# EAGLE schematic power-control (EAGLE 6.4)
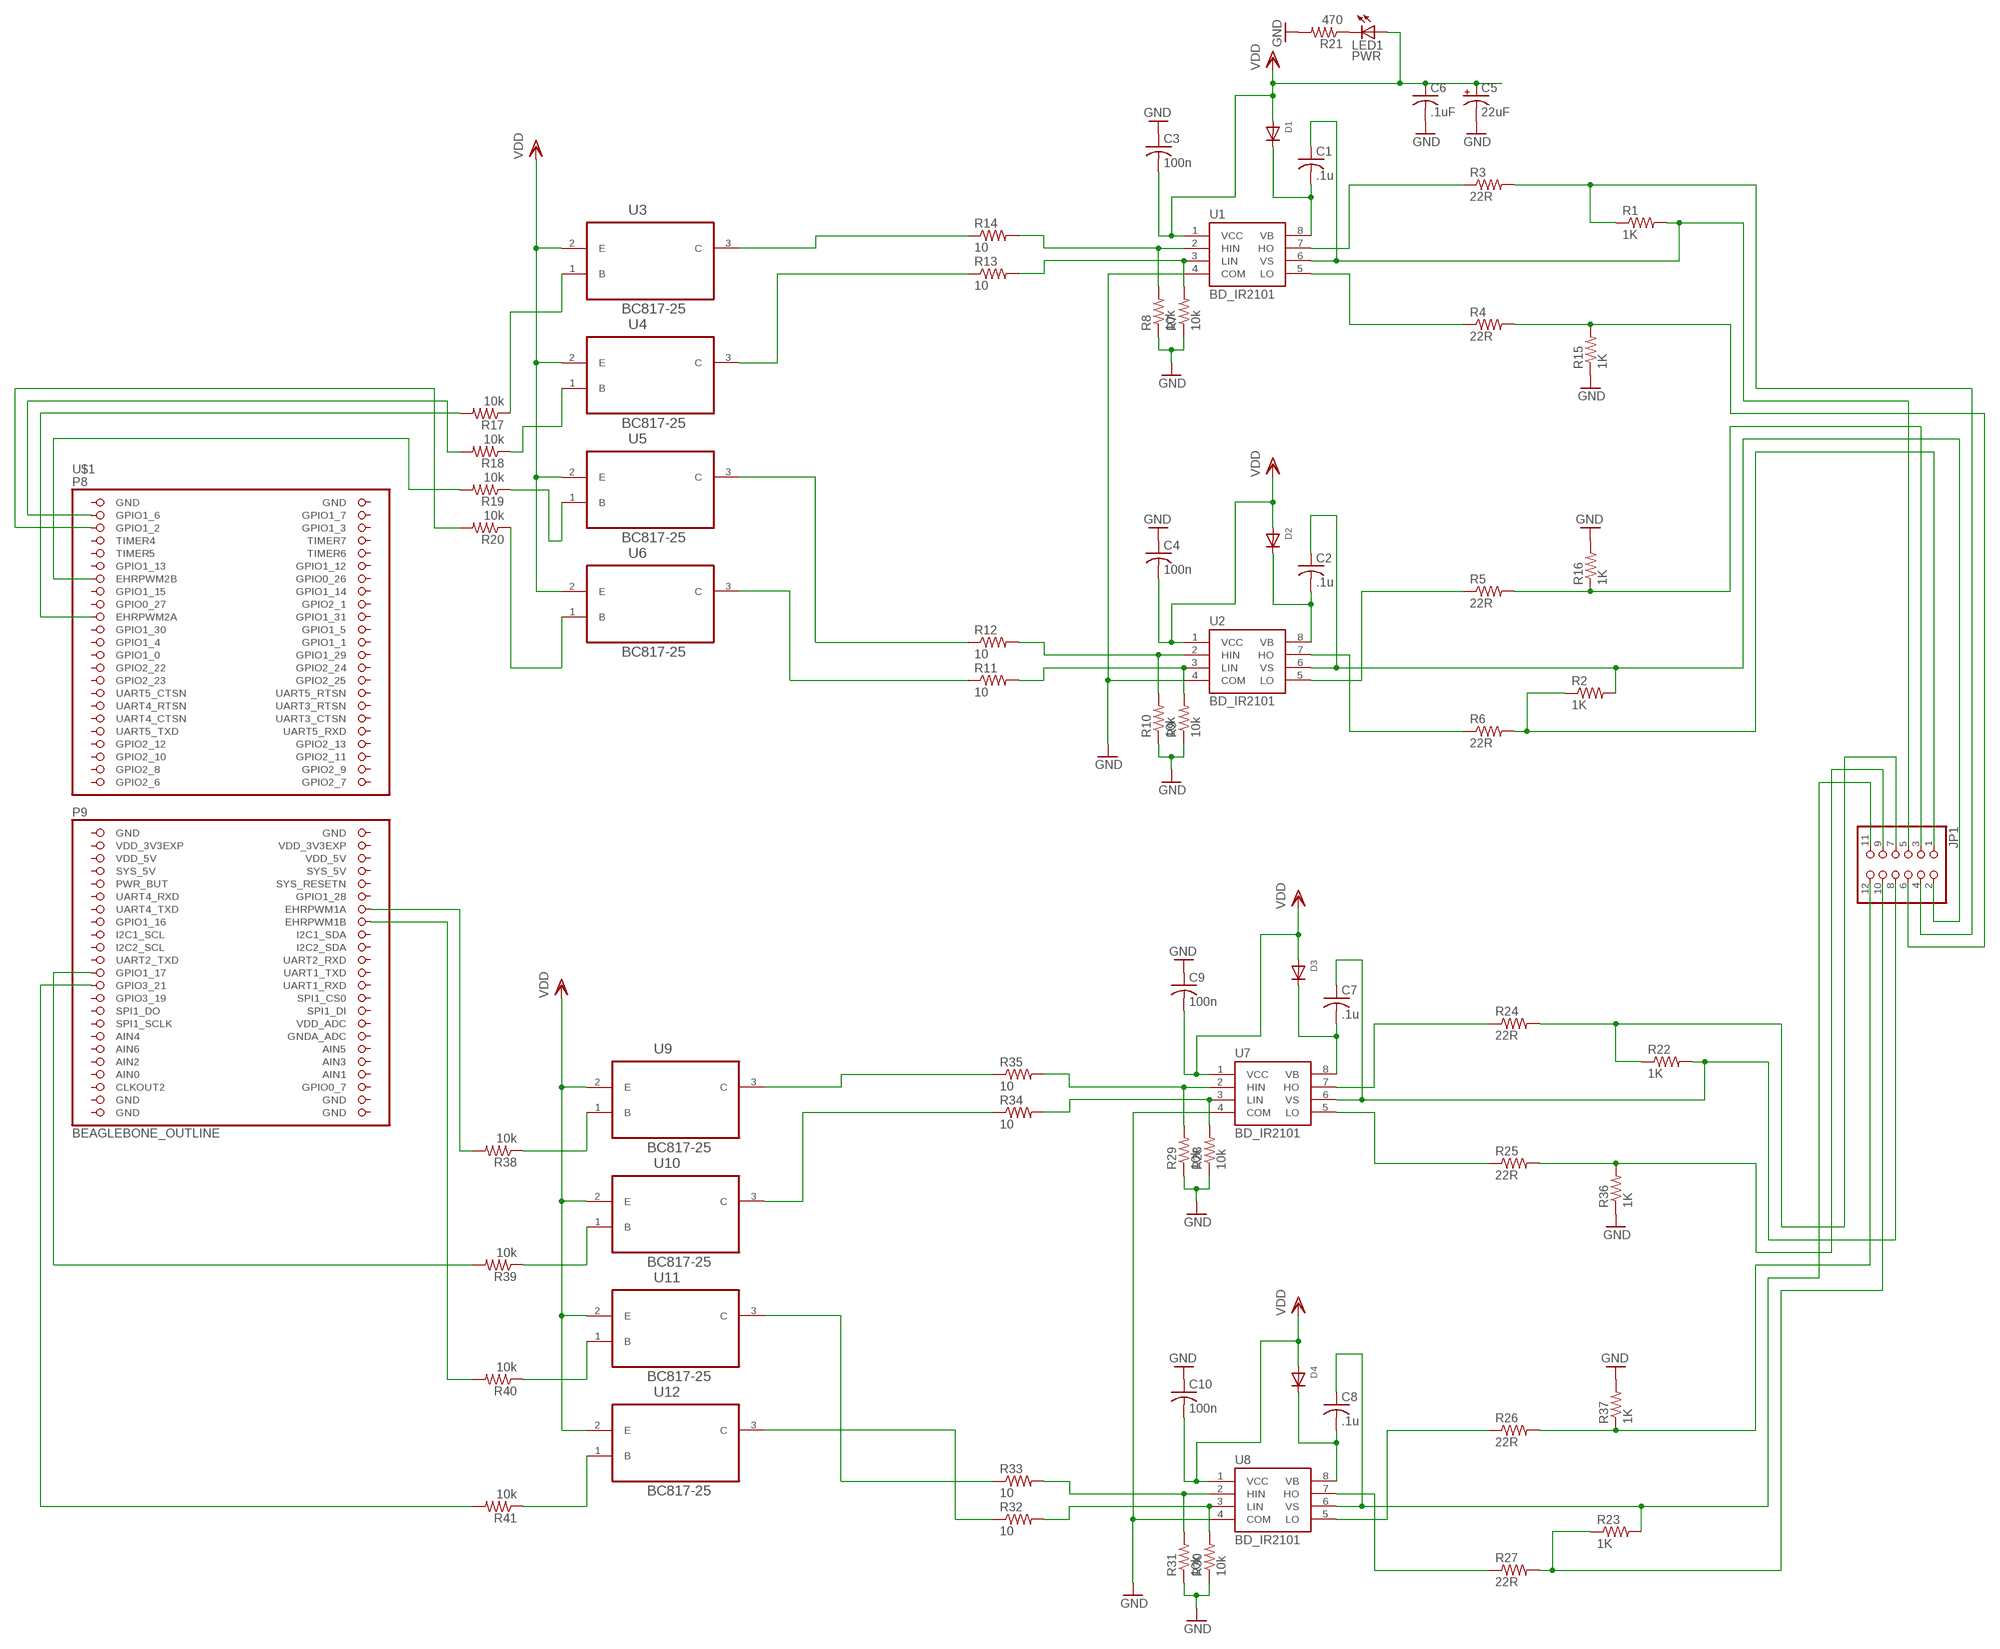
[diagram p0: schematic, sheet 1]

## Parts
C1  .1u  C-USC0402  [C0402]
C2  .1u  C-USC0402  [C0402]
C3  100n  C-USC0402  [C0402]
C4  100n  C-USC0402  [C0402]
C5  22uF  CPOL-USB/3528-21W  [B/3528-21W]
C6  .1uF  C-USC0805  [C0805]
C7  .1u  C-USC0402  [C0402]
C8  .1u  C-USC0402  [C0402]
C9  100n  C-USC0402  [C0402]
C10  100n  C-USC0402  [C0402]
D1  DIODESOD-523  [SOD-523]
D2  DIODESOD-523  [SOD-523]
D3  DIODESOD-523  [SOD-523]
D4  DIODESOD-523  [SOD-523]
JP1  PINHD-2X6_2.00  [2X06M]
LED1  PWR  LEDCHIP-LED0805  [CHIP-LED0805]
R1  1K  R-US_R0201  [R0201]
R2  1K  R-US_R0201  [R0201]
R3  22R  R-US_R0201  [R0201]
R4  22R  R-US_R0201  [R0201]
R5  22R  R-US_R0201  [R0201]
R6  22R  R-US_R0201  [R0201]
R7  10k  R-US_R0201  [R0201]
R8  10k  R-US_R0201  [R0201]
R9  10k  R-US_R0201  [R0201]
R10  10k  R-US_R0201  [R0201]
R11  10  R-US_R0201  [R0201]
R12  10  R-US_R0201  [R0201]
R13  10  R-US_R0201  [R0201]
R14  10  R-US_R0201  [R0201]
R15  1K  R-US_R0201  [R0201]
R16  1K  R-US_R0201  [R0201]
R17  10k  R-US_R0201  [R0201]
R18  10k  R-US_R0201  [R0201]
R19  10k  R-US_R0201  [R0201]
R20  10k  R-US_R0201  [R0201]
R21  470  R-US_R0201  [R0201]
R22  1K  R-US_R0201  [R0201]
R23  1K  R-US_R0201  [R0201]
R24  22R  R-US_R0201  [R0201]
R25  22R  R-US_R0201  [R0201]
R26  22R  R-US_R0201  [R0201]
R27  22R  R-US_R0201  [R0201]
R28  10k  R-US_R0201  [R0201]
R29  10k  R-US_R0201  [R0201]
R30  10k  R-US_R0201  [R0201]
R31  10k  R-US_R0201  [R0201]
R32  10  R-US_R0201  [R0201]
R33  10  R-US_R0201  [R0201]
R34  10  R-US_R0201  [R0201]
R35  10  R-US_R0201  [R0201]
R36  1K  R-US_R0201  [R0201]
R37  1K  R-US_R0201  [R0201]
R38  10k  R-US_R0201  [R0201]
R39  10k  R-US_R0201  [R0201]
R40  10k  R-US_R0201  [R0201]
R41  10k  R-US_R0201  [R0201]
U1  BD_IR2101  [SO8]
U2  BD_IR2101  [SO8]
U3  BC817-25  [SOT95P240X97-3N]
U4  BC817-25  [SOT95P240X97-3N]
U5  BC817-25  [SOT95P240X97-3N]
U6  BC817-25  [SOT95P240X97-3N]
U7  BD_IR2101  [SO8]
U8  BD_IR2101  [SO8]
U9  BC817-25  [SOT95P240X97-3N]
U10  BC817-25  [SOT95P240X97-3N]
U11  BC817-25  [SOT95P240X97-3N]
U12  BC817-25  [SOT95P240X97-3N]
U$1  BEAGLEBONE_OUTLINE  [BEAGLEBONE_SHIELD]

## Nets
GND: C3.1 C4.1 C5.- C6.2 C9.1 C10.1 R7.1 R8.1 R9.1 R10.1 R15.1 R16.2 R21.2 R28.1 R29.1 R30.1 R31.1 R36.1 R37.2 U1.4(COM) U2.4(COM) U7.4(COM) U8.4(COM)
HO_1: R3.1 U1.7(HO)
HO_2: R6.1 U2.7(HO)
HO_3: R24.1 U7.7(HO)
HO_4: R27.1 U8.7(HO)
LO_1: R4.1 U1.5(LO)
LO_2: R5.1 U2.5(LO)
LO_3: R25.1 U7.5(LO)
LO_4: R26.1 U8.5(LO)
M1_G1_H: JP1.4 R1.1 R3.2
M1_G1_L: JP1.6 R4.2 R15.2
M1_G2_H: JP1.1 R2.1 R6.2
M1_G2_L: JP1.3 R5.2 R16.1
M2_G1_H: JP1.7 R22.1 R24.2
M2_G1_L: JP1.9 R25.2 R36.2
M2_G2_H: JP1.10 R23.1 R27.2
M2_G2_L: JP1.12 R26.2 R37.1
MOTOR_OUT_1: C1.1 JP1.5 R1.2 U1.6(VS)
MOTOR_OUT_2: C2.1 JP1.2 R2.2 U2.6(VS)
MOTOR_OUT_3: C7.1 JP1.8 R22.2 U7.6(VS)
MOTOR_OUT_4: C8.1 JP1.11 R23.2 U8.6(VS)
N$1: R13.1 U4.3(C)
N$2: R11.1 U6.3(C)
N$3: R8.2 R14.2 U1.2(HIN)
N$4: R7.2 R13.2 U1.3(LIN)
N$5: R10.2 R12.2 U2.2(HIN)
N$6: R9.2 R11.2 U2.3(LIN)
N$7: C1.2 D1.K(C) U1.8(VB)
N$8: C2.2 D2.K(C) U2.8(VB)
N$9: R12.1 U5.3(C)
N$10: R19.2 U$1.13(EHRPWM2B)
N$11: R14.1 U3.3(C)
N$12: R18.2 U$1.3(GPIO1_6)
N$13: R20.2 U$1.5(GPIO1_2)
N$14: R38.2 U$1.60(EHRPWM1A)
N$15: R40.2 U$1.62(EHRPWM1B)
N$16: R39.2 U$1.69(GPIO1_17)
N$17: R17.1 U3.1(B)
N$18: R18.1 U4.1(B)
N$19: R19.1 U5.1(B)
N$20: R17.2 U$1.19(EHRPWM2A)
N$21: R20.1 U6.1(B)
N$22: LED1.C R21.1
N$23: R29.2 R35.2 U7.2(HIN)
N$24: R28.2 R34.2 U7.3(LIN)
N$25: R41.2 U$1.71(GPIO3_21)
N$26: R31.2 R33.2 U8.2(HIN)
N$27: R30.2 R32.2 U8.3(LIN)
N$28: C7.2 D3.K(C) U7.8(VB)
N$29: C8.2 D4.K(C) U8.8(VB)
N$30: R34.1 U10.3(C)
N$31: R35.1 U9.3(C)
N$32: R32.1 U12.3(C)
N$33: R33.1 U11.3(C)
N$42: R38.1 U9.1(B)
N$43: R39.1 U10.1(B)
N$44: R40.1 U11.1(B)
N$45: R41.1 U12.1(B)
VDD: C3.2 C4.2 C5.+ C6.1 C9.2 C10.2 D1.A D2.A D3.A D4.A LED1.A U1.1(VCC) U2.1(VCC) U3.2(E) U4.2(E) U5.2(E) U6.2(E) U7.1(VCC) U8.1(VCC) U9.2(E) U10.2(E) U11.2(E) U12.2(E)
Unconnected: U$1.4(GPIO1_7) U$1.6(GPIO1_3) U$1.7(TIMER4) U$1.8(TIMER7) U$1.9(TIMER5) U$1.10(TIMER6) U$1.11(GPIO1_13) U$1.12(GPIO1_12) U$1.14(GPIO0_26) U$1.15(GPIO1_15) U$1.16(GPIO1_14) U$1.17(GPIO0_27) U$1.18(GPIO2_1) U$1.20(GPIO1_31) U$1.21(GPIO1_30) U$1.22(GPIO1_5) U$1.23(GPIO1_4) U$1.24(GPIO1_1) U$1.25(GPIO1_0) U$1.26(GPIO1_29) U$1.27(GPIO2_22) U$1.28(GPIO2_24) U$1.29(GPIO2_23) U$1.30(GPIO2_25) U$1.31(UART5_CTSN) U$1.32(UART5_RTSN) U$1.33(UART4_RTSN) U$1.34(UART3_RTSN) U$1.35(UART4_CTSN) U$1.36(UART3_CTSN) U$1.37(UART5_TXD) U$1.38(UART5_RXD) U$1.39(GPIO2_12) U$1.40(GPIO2_13) U$1.41(GPIO2_10) U$1.42(GPIO2_11) U$1.43(GPIO2_8) U$1.44(GPIO2_9) U$1.45(GPIO2_6) U$1.46(GPIO2_7) U$1.54(SYS_5V) U$1.55(PWR_BUT) U$1.56(SYS_RESETN) U$1.57(UART4_RXD) U$1.58(GPIO1_28) U$1.59(UART4_TXD) U$1.61(GPIO1_16) U$1.63(I2C1_SCL) U$1.64(I2C1_SDA) U$1.65(I2C2_SCL) U$1.66(I2C2_SDA) U$1.67(UART2_TXD) U$1.68(UART2_RXD) U$1.70(UART1_TXD) U$1.72(UART1_RXD) U$1.73(GPIO3_19) U$1.74(SPI1_CS0) U$1.75(SPI1_DO) U$1.76(SPI1_DI) U$1.77(SPI1_SCLK) U$1.78(VDD_ADC) U$1.79(AIN4) U$1.80(GNDA_ADC) U$1.81(AIN6) U$1.82(AIN5) U$1.83(AIN2) U$1.84(AIN3) U$1.86(AIN1) U$1.87(CLKOUT2) U$1.88(GPIO0_7)

## Power pins joined to a net without a drawn wire
AIN0: U$1.85(AIN0)
GND: U$1.1(GND) U$1.2(GND) U$1.47(GND) U$1.48(GND) U$1.89(GND) U$1.90(GND) U$1.91(GND) U$1.92(GND)
SYS_5V: U$1.53(SYS_5V)
VDD_3V3EXP: U$1.49(VDD_3V3EXP) U$1.50(VDD_3V3EXP)
VDD_5V: U$1.51(VDD_5V) U$1.52(VDD_5V)

## Library data of the parts
C1-C4 C6-C10 = rcl:C-US: CAPACITOR, American symbol
C5 = rcl:CPOL-US: POLARIZED CAPACITOR, American symbol
D1-D4 = adafruit:DIODE: Diode SMADIODE - SMA Surface Mount Package 20V 1A Schottky Diode Digikey: 641-1014-6-ND DO-1N4148 - Through Hole Small Current Diode SOD-123 20V 1 A (.5mV Vf) Schottky Diode - Digikey: MBRX120TPMSCT-ND SOD-323 10V 570mA (.38mV Vf, 3ns) Schottky Diode - Digikey: ZLLS410CT-ND SOD-523 30V 30mA Schottky Diode (RB751S-40TE61) - Digikey: RB751S-40TE61CT-ND SOT23-R/W - SOT23 Package (R = Solder Paste/Reflow Ovens, W = Hand-Soldering) BAT54Film 40V 300mA - Digikey: 497-7162-1-ND
JP1 = pinhead-1:PINHD-2X6: PIN HEADER
LED1 = adafruit:LED: LED OSRAM: - CHIPLED LG R971, LG N971, LY N971, LG Q971, LY Q971, LO R971, LY R971 LH N974, LH R974 LS Q976, LO Q976, LY Q976 LO Q996 - Hyper CHIPLED LW Q18S LB Q993, LB Q99A, LB R99A - SideLED LS A670, LO A670, LY A670, LG A670, LP A670 LB A673, LV A673, LT A673, LW A673 LH A674 LY A675 LS A676, LA A676, LO A676, LY A676, LW A676 LS A679, LY A679, LG A679 - Hyper Micro SIDELED® LS Y876, LA Y876, LO Y876, LY Y876 LT Y87S - SmartLED LW L88C, LW L88S LB L89C, LB L89S, LG L890 LS L89K, LO L89K, LY L89K LS L896, LA L896, LO L896, LY L896 - TOPLED LS T670, LO T670, LY T670, LG T670, LP T670 LSG T670, LSP T670, LSY T670, LOP T670, LYG T670 LG T671, LOG T671, LSG T671 LB T673, LV T673, LT T673, LW T673 LH T674 LS T676, LA T676, LO T676, LY T676, LB T676, LH T676, LSB T676, LW T676 LB T67C, LV T67C, LT T67C, LS T67K, LO T67K, LY T67K, LW E67C LS E67B, LA E67B, LO E67B, LY E67B, LB E67C, LV E67C, LT E67C LW T67C LS T679, LY T679, LG T679 LS T770, LO T770, LY T770, LG T770, LP T770 LB T773, LV T773, LT T773, LW T773 LH T774 LS E675, LA E675, LY E675, LS T675 LS T776, LA T776, LO T776, LY T776, LB T776 LHGB T686 LT T68C, LB T68C - Hyper Mini TOPLED® LB M676 - Mini TOPLED Santana® LG M470 LS M47K, LO M47K, LY M47K Source: http://www.osram.convergy.de/
R1-R41 = rcl:R-US_: RESISTOR, American symbol
U1 U2 U7 U8 = open-bldc:BD
U3-U6 U9-U12 = Fairchild_By_element14_Batch_1:BC817-25: NPN Epitaxial Silicon Transistor; MPN: BC817-25; OC_FARNELL: 1228216; OC_NEWARK: -; PACKAGE: SOT-3; SUPPLIER: Fairchild
U$1 = adafruit:BEAGLEBONE_OUTLINE: Should match A3 pinout - but not completely tested